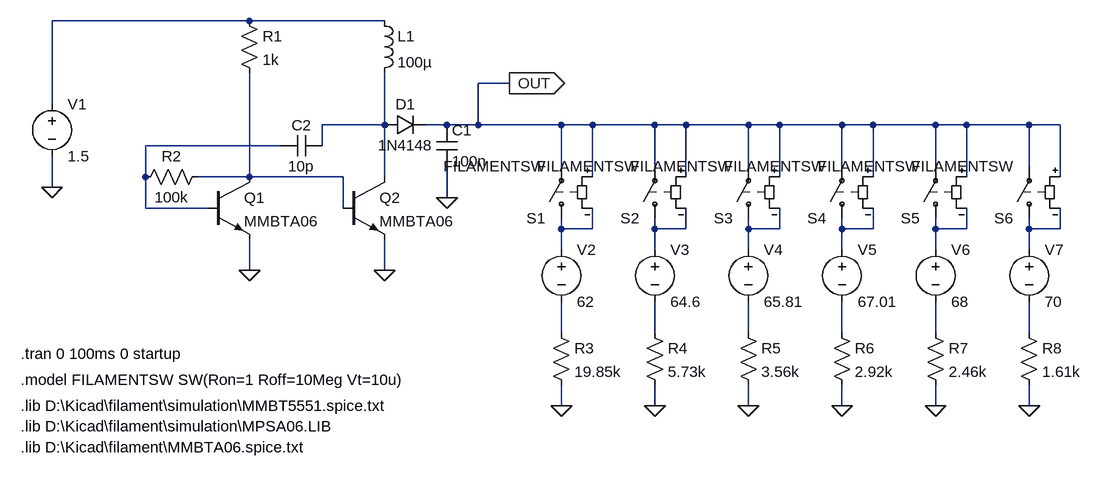
[diagram p0: schematic filament.asc]
filament.asc, the LTspice schematic file:
Version 4
SHEET 1 3272 680
WIRE 320 -16 16 -16
WIRE 528 -16 320 -16
WIRE 720 80 672 80
WIRE 16 112 16 -16
WIRE 528 144 528 64
WIRE 528 144 432 144
WIRE 624 144 592 144
WIRE 672 144 672 80
WIRE 672 144 624 144
WIRE 800 144 672 144
WIRE 848 144 800 144
WIRE 944 144 848 144
WIRE 992 144 944 144
WIRE 1088 144 992 144
WIRE 1136 144 1088 144
WIRE 1232 144 1136 144
WIRE 1280 144 1232 144
WIRE 1376 144 1280 144
WIRE 1424 144 1376 144
WIRE 1520 144 1424 144
WIRE 1568 144 1520 144
WIRE 368 176 160 176
WIRE 432 176 432 144
WIRE 800 208 800 144
WIRE 944 208 944 144
WIRE 1088 208 1088 144
WIRE 1232 208 1232 144
WIRE 1376 208 1376 144
WIRE 1520 208 1520 144
WIRE 160 224 160 176
WIRE 320 224 320 64
WIRE 320 224 240 224
WIRE 464 224 320 224
WIRE 528 224 528 144
WIRE 848 224 848 144
WIRE 992 224 992 144
WIRE 1136 224 1136 144
WIRE 1280 224 1280 144
WIRE 1424 224 1424 144
WIRE 1568 224 1568 144
WIRE 16 240 16 192
WIRE 624 256 624 208
WIRE 160 272 160 224
WIRE 256 272 160 272
WIRE 464 272 464 224
WIRE 800 304 800 288
WIRE 848 304 848 272
WIRE 848 304 800 304
WIRE 944 304 944 288
WIRE 992 304 992 272
WIRE 992 304 944 304
WIRE 1088 304 1088 288
WIRE 1136 304 1136 272
WIRE 1136 304 1088 304
WIRE 1232 304 1232 288
WIRE 1280 304 1280 272
WIRE 1280 304 1232 304
WIRE 1376 304 1376 288
WIRE 1424 304 1424 272
WIRE 1424 304 1376 304
WIRE 1520 304 1520 288
WIRE 1568 304 1568 272
WIRE 1568 304 1520 304
WIRE 800 336 800 304
WIRE 944 336 944 304
WIRE 1088 336 1088 304
WIRE 1232 336 1232 304
WIRE 1376 336 1376 304
WIRE 1520 336 1520 304
WIRE 320 368 320 320
WIRE 528 368 528 320
WIRE 800 464 800 416
WIRE 944 464 944 416
WIRE 1088 464 1088 416
WIRE 1232 464 1232 416
WIRE 1376 464 1376 416
WIRE 1520 464 1520 416
WIRE 800 576 800 544
WIRE 944 576 944 544
WIRE 1088 576 1088 544
WIRE 1232 576 1232 544
WIRE 1376 576 1376 544
WIRE 1520 576 1520 544
FLAG 16 240 0
FLAG 320 368 0
FLAG 528 368 0
FLAG 624 256 0
FLAG 720 80 OUT
IOPIN 720 80 Out
FLAG 800 576 0
FLAG 944 576 0
FLAG 1088 576 0
FLAG 1232 576 0
FLAG 1376 576 0
FLAG 1520 576 0
SYMBOL voltage 16 96 R0
WINDOW 123 0 0 Left 0
WINDOW 39 0 0 Left 0
SYMATTR InstName V1
SYMATTR Value 1.5
SYMBOL res 304 -32 R0
SYMATTR InstName R1
SYMATTR Value 1k
SYMBOL res 256 208 R90
WINDOW 0 0 56 VBottom 2
WINDOW 3 32 56 VTop 2
SYMATTR InstName R2
SYMATTR Value 100k
SYMBOL cap 608 144 R0
SYMATTR InstName C1
SYMATTR Value 100n
SYMBOL cap 368 192 R270
WINDOW 0 32 32 VTop 2
WINDOW 3 0 32 VBottom 2
SYMATTR InstName C2
SYMATTR Value 10p
SYMBOL diode 528 160 R270
WINDOW 0 32 32 VTop 2
WINDOW 3 0 32 VBottom 2
SYMATTR InstName D1
SYMATTR Value 1N4148
SYMBOL npn 256 224 R0
SYMATTR InstName Q1
SYMATTR Value MMBTA06
SYMBOL npn 464 224 R0
SYMATTR InstName Q2
SYMATTR Value MMBTA06
SYMBOL ind 512 -32 R0
SYMATTR InstName L1
SYMATTR Value 100µ
SYMATTR SpiceLine Ipk=1 Rser=0.4 Rpar=76361.7 Cpar=0 mfg="Bourns, Inc." pn="SRN8040-101M"
SYMBOL voltage 800 320 R0
WINDOW 123 0 0 Left 0
WINDOW 39 24 124 Left 2
SYMATTR InstName V2
SYMATTR Value 62
SYMBOL res 784 448 R0
SYMATTR InstName R3
SYMATTR Value 19.85k
SYMBOL sw 944 304 R180
SYMATTR InstName S2
SYMATTR Value FILAMENTSW
SYMBOL voltage 944 320 R0
WINDOW 123 0 0 Left 0
WINDOW 39 24 124 Left 2
SYMATTR InstName V3
SYMATTR Value 64.6
SYMBOL res 928 448 R0
SYMATTR InstName R4
SYMATTR Value 5.73k
SYMBOL sw 1088 304 R180
SYMATTR InstName S3
SYMATTR Value FILAMENTSW
SYMBOL voltage 1088 320 R0
WINDOW 123 0 0 Left 0
WINDOW 39 24 124 Left 2
SYMATTR InstName V4
SYMATTR Value 65.81
SYMBOL res 1072 448 R0
SYMATTR InstName R5
SYMATTR Value 3.56k
SYMBOL sw 1232 304 R180
SYMATTR InstName S4
SYMATTR Value FILAMENTSW
SYMBOL voltage 1232 320 R0
WINDOW 123 0 0 Left 0
WINDOW 39 24 124 Left 2
SYMATTR InstName V5
SYMATTR Value 67.01
SYMBOL res 1216 448 R0
SYMATTR InstName R6
SYMATTR Value 2.92k
SYMBOL sw 1376 304 R180
SYMATTR InstName S5
SYMATTR Value FILAMENTSW
SYMBOL voltage 1376 320 R0
WINDOW 123 0 0 Left 0
WINDOW 39 24 124 Left 2
SYMATTR InstName V6
SYMATTR Value 68
SYMBOL res 1360 448 R0
SYMATTR InstName R7
SYMATTR Value 2.46k
SYMBOL sw 1520 304 R180
SYMATTR InstName S6
SYMATTR Value FILAMENTSW
SYMBOL voltage 1520 320 R0
WINDOW 123 0 0 Left 0
WINDOW 39 24 124 Left 2
SYMATTR InstName V7
SYMATTR Value 70
SYMBOL res 1504 448 R0
SYMATTR InstName R8
SYMATTR Value 1.61k
SYMBOL sw 800 304 R180
SYMATTR InstName S1
SYMATTR Value FILAMENTSW
TEXT -32 496 Left 2 !.tran 0 100ms 0 startup
TEXT -32 536 Left 2 !.model FILAMENTSW SW(Ron=1 Roff=10Meg Vt=10u)
TEXT -32 576 Left 2 !.lib D:\\Kicad\\filament\\simulation\\MMBT5551.spice.txt
TEXT -32 608 Left 2 !.lib D:\\Kicad\\filament\\simulation\\MPSA06.LIB
TEXT -32 640 Left 2 !.lib D:\\Kicad\\filament\\MMBTA06.spice.txt

The netlist it stands for:
* filament.asc
V1 N001 0 1.5
R1 N001 N004 1k
R2 N004 N003 100k
C1 OUT 0 100n
C2 N003 N002 10p
D1 N002 OUT 1N4148
Q1 N004 N003 0 0 MMBTA06
Q2 N002 N004 0 0 MMBTA06
L1 N001 N002 100µ Ipk=1 Rser=0.4 Rpar=76361.7 Cpar=0 mfg="Bourns, Inc." pn="SRN8040-101M"
V2 N005 N011 62
R3 N011 0 19.85k
S2 N006 OUT OUT N006 FILAMENTSW
V3 N006 N012 64.6
R4 N012 0 5.73k
S3 N007 OUT OUT N007 FILAMENTSW
V4 N007 N013 65.81
R5 N013 0 3.56k
S4 N008 OUT OUT N008 FILAMENTSW
V5 N008 N014 67.01
R6 N014 0 2.92k
S5 N009 OUT OUT N009 FILAMENTSW
V6 N009 N015 68
R7 N015 0 2.46k
S6 N010 OUT OUT N010 FILAMENTSW
V7 N010 N016 70
R8 N016 0 1.61k
S1 N005 OUT OUT N005 FILAMENTSW
.model D D
.lib standard.dio
.model NPN NPN
.model PNP PNP
.lib standard.bjt
.tran 0 100ms 0 startup
.model FILAMENTSW SW(Ron=1 Roff=10Meg Vt=10u)
.lib D:\Kicad\filament\simulation\MMBT5551.spice.txt
.lib D:\Kicad\filament\simulation\MPSA06.LIB
.lib D:\Kicad\filament\MMBTA06.spice.txt
.backanno
.end